# Altium schematic sheet MCU.SchDoc: Microcontroller
size A3; DrawnBy: Zoe Goodward; DocumentNumber: 2; Revision: 01; SheetNumber: 2; SheetTotal: 10; Version: 01; Project: Battery Managment System 2020; PageSetup: Record=PageOptions|CenterHorizontal=True|CenterVertical=True|PrintScale=0.97|XCorrection=1.00|YCorrection=1.00|PrintKind=0|BorderSize=5000000|LeftOffset=0|BottomOffset=0|Orientation=2|PaperLength=1000|PaperWidth=1000|Scale=100|PaperSource=7|PrintQuality=-4|MediaType=1|DitherType=10|PaperKind=A4|PrintScaleMode=1
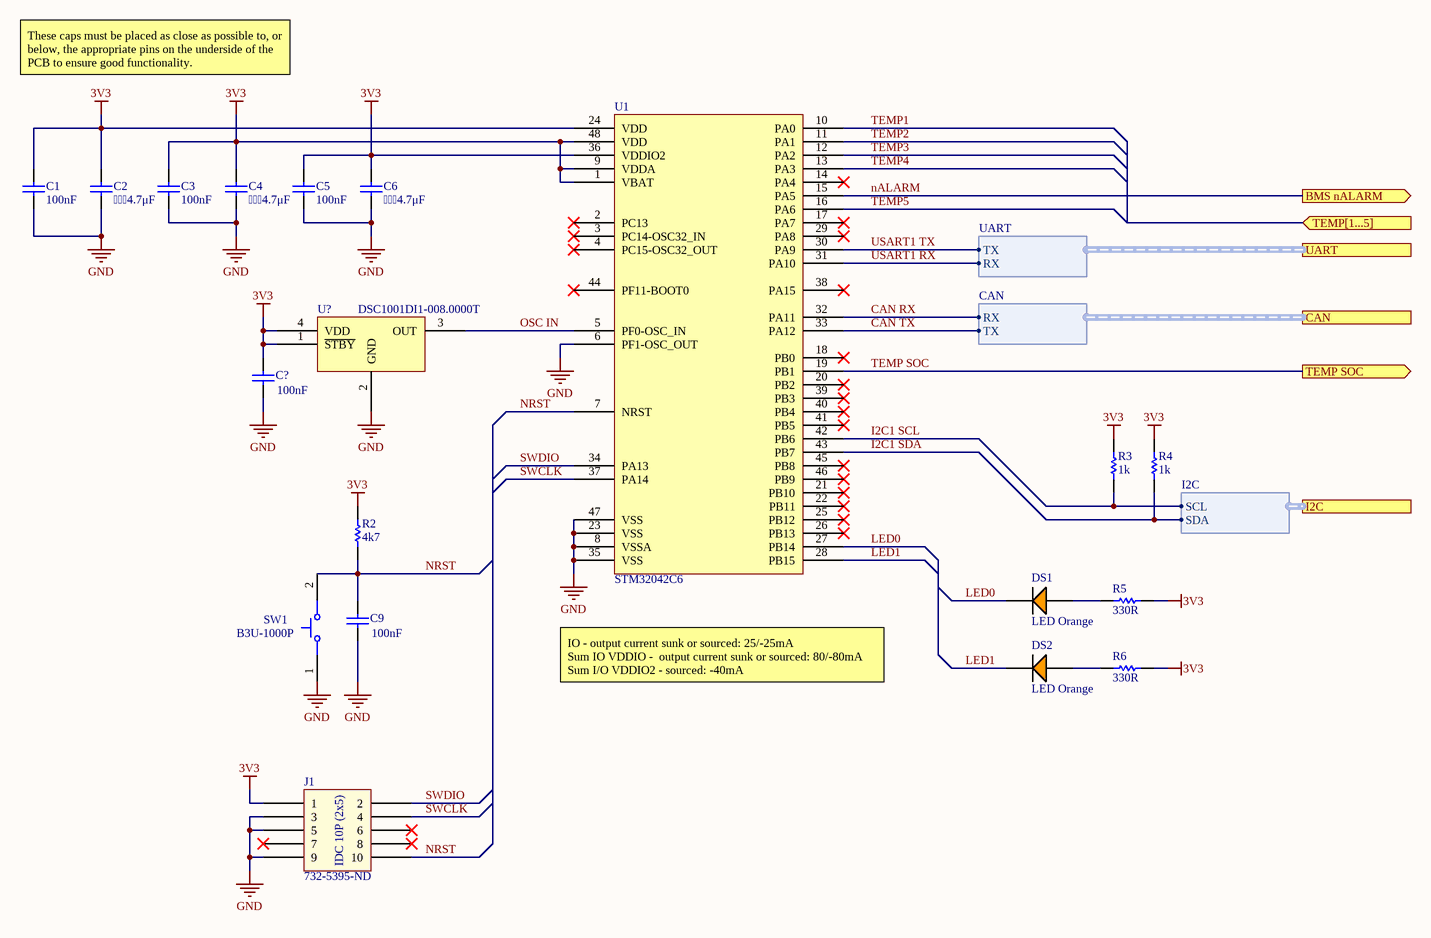
[diagram p0: MCU.SchDoc]

## Parts
C1  100nF  [CAPC1608X90X35ML15T15]
C2  4.7μF  [CAPC1608X87X35NL15T15]
C3  100nF  [CAPC1608X90X35ML15T15]
C4  4.7μF  [CAPC1608X87X35NL15T15]
C5  100nF  [CAPC1608X90X35ML15T15]
C6  4.7μF  [CAPC1608X87X35NL15T15]
C9  100nF  [CAPC0603(1608)100_N]
C?  100nF  [CAPC0603(1608)100_N]
DS1  LED Orange  [LED ORANGE 0603]
DS2  LED Orange  [LED ORANGE 0603]
J1  732-5395-ND  [IDC_10P]
R2  4k7  [RESC0603(1608)_N]
R3  1k  [RESC1608X55X30ML15T15]
R4  1k  [RESC1608X55X30ML15T15]
R5  330R  [RESC0603(1608)_L]
R6  330R  [RESC0603(1608)_L]
SW1  B3U-1000P  [OMRON-B3U-1000_V]
U1  STM32042C6  [STM32F042C6]
U?  DSC1001DI1-008.0000T  [DSC1001DI1-008.0000TCT-ND]

## Ports
BMS nALARM (out), CAN (harness CAN), I2C (harness I2C), TEMP SOC (out), TEMP[1...5] (in), UART (harness UART)

## Harnesses
I2C: SCL, SDA
CAN: RX, TX
UART: TX, RX

## Nets
3V3: C1.2 C2.2 C3.2 C4.2 C5.2 C6.2 C?.2 J1.1 R2.2 R3.2 R4.2 R5.1 R6.1 U1.1(VBAT) U1.9(VDDA) U1.24(VDD) U1.36(VDDIO2) U1.48(VDD) U?.1(~{STBY}) U?.4(VDD)
GND: C1.1 C2.1 C3.1 C4.1 C5.1 C6.1 C9.1 C?.1 J1.3 J1.5 J1.9 SW1.1 U1.6(PF1-OSC_OUT) U1.8(VSSA) U1.23(VSS) U1.35(VSS) U1.47(VSS) U?.2(GND)
CAN RX: U1.32(PA11) ; port CAN.RX
CAN TX: U1.33(PA12) ; port CAN.TX
I2C1 SCL: R3.1 U1.42(PB6) ; port I2C.SCL
I2C1 SDA: R4.1 U1.43(PB7) ; port I2C.SDA
LED0: DS1.2(C) U1.27(PB14)
LED1: DS2.2(C) U1.28(PB15)
nALARM: U1.15(PA5) ; port BMS nALARM
NRST: C9.2 J1.10 R2.1 SW1.2 U1.7(NRST)
OSC IN: U1.5(PF0-OSC_IN) U?.3(OUT)
SWCLK: J1.4 U1.37(PA14)
SWDIO: J1.2 U1.34(PA13)
TEMP1: U1.10(PA0)
TEMP2: U1.11(PA1)
TEMP3: U1.12(PA2)
TEMP4: U1.13(PA3)
TEMP5: U1.16(PA6)
TEMP SOC: U1.19(PB1) ; port TEMP SOC
USART1 RX: U1.31(PA10) ; port UART.RX
USART1 TX: U1.30(PA9) ; port UART.TX
NetDS1_1: DS1.1(A) R5.2
NetDS2_1: DS2.1(A) R6.2

Not connected (* = marked no-connect by the designer): J1 6* 7* 8*; U1 2(PC13)* 3(PC14-OSC32_IN)* 4(PC15-OSC32_OUT)* 14(PA4)* 17(PA7)* 18(PB0)* 20(PB2)* 21(PB10)* 22(PB11)* 25(PB12)* 26(PB13)* 29(PA8)* 38(PA15)* 39(PB3)* 40(PB4)* 41(PB5)* 44(PF11-BOOT0)* 45(PB8)* 46(PB9)*

## Notes on the sheet
- These caps must be placed as close as possible to, or below, the appropriate pins on the underside of the PCB to ensure good functionality.
- IO - output current sunk or sourced: 25/-25mA
  Sum IO VDDIO -  output current sunk or sourced: 80/-80mA
  Sum I/O VDDIO2 - sourced: -40mA
- Revision History:
- Sheet Title:
- Rev
- Date
- Description
- Project:
- Size:
- Drawn By:
- A3
- Number:
- Revision:
- Sheet
- Version:
- of
- QUT Motorsport
- O-120, Gardens Point
- 2 George Street
- Brisbane, QLD 4000
- Australia
- Print Date:
- Print Time:
- File Name:
- (in symbol IDC_10P_2x5) IDC 10P (2x5)

## Library data of the parts
C1 C3 C5 = CMP-2006-04387-1: Manufacturer: AVX Interconnect / Elco; Part Number: 06035C104K4T4A
C2 C4 C6 = CMP-2006-03238-1: Part Number: C0603C475K8PACTU; Manufacturer: Kemet
C9 C? = CMP-1035-02584-1: CAP 100nF 16V ±10% 0603 (1608 Metric) Thickness 1mm SMD; Tolerance: Â±10%; Case-EIA: 0603; Case-Metric: 1608; Technology: SMT; Max Thickness: 1 mm; Value: 100nF; Rated Voltage: 16 V
DS1 DS2 = LED ORANGE 0603
J1 = IDC_10P_2x5
R2 = CMP-1012-00098-1: 10K 0.1W 5% 0603 (1608 Metric)  SMD; Case-EIA: 0603; Value: 10000.00 Ohm; Case-Metric: 1608; Technology: SMT; Tolerance: 5 %; Power: 0.1 W
R3 R4 = CMP-2000-00703-1: Part Number: ERJ-3GEYJ102V; Manufacturer: Panasonic
R5 R6 = CMP-1012-00062-1: 330R 0.1W 5% 0603 (1608 Metric)  SMD; Value: 330.00 Ohm; Case-EIA: 0603; Case-Metric: 1608; Tolerance: 5 %; Power: 0.1 W; Technology: SMT
SW1 = CMP-2100-03586-1: Ultra-Small Tactile Switch, 0.05 A, 12 V, -25 to 70 degC, 2-Pin SMD, RoHS, Tape and Reel; Manufacturer: Omron Electronic Components; Operating Force: 1.5N; Current Rating: 50mA; Voltage Rating (DC): 12V; Electrical Life: 200000Cycles; Actuator Length: 0.4mm; Insulation Resistance: 100MOhm; Switch Travel: 0.15mm; Throw Configuration: SPST; Illumination Type: Illuminated; Width: 3mm; Weight: 0.022g; Datasheet Version: 42005.0; Datasheet URL: http://www.omron.com/ecb/products/pdf/en-b3u.pdf; Height: 1.2mm; Package Quantity: 1; REACH SVHC: Unknown; Contact Current Rating: 50mA; Contact Material: Silver; Max Current Rating: 50mA; Package Reference: B3U-1000; Termination: SMD/SMT; Packaging: TapeandReel; Manufacturer URL: http://www.omron.com/; RoHSCompliant: true; Mount: SurfaceMount; Length: 4mm; Min Operating Temperature: -25degC; Depth: 2.5mm; Lead Free: LeadFree; Case/Package: SMD/SMT; Package Description: 2-Pin Surface Mount Device, Body 3 x 2.5 mm; Max Operating Temperature: 70degC; Orientation: Straight
U1 = STM32042C6: ARM® Cortex®-M0 STM32F0 Microcontroller IC 32-Bit 48MHz 32KB (32K x 8) FLASH 48-LQFP (7x7); ComponentLink1Description: Digikey; ComponentLink1URL: https://www.digikey.com.au/product-detail/en/stmicroelectronics/STM32F042C6T6TR/497-19319-1-ND/10063344; ComponentLink2Description: Datasheet; ComponentLink2URL: https://www.st.com/resource/en/datasheet/stm32f042k6.pdf
U? = DSC1001DI1-008.0000T: on 8MHz XO (Standard) CMOS Oscillator 1.8 ~ 3.3V Standby (Power Down) 4-SMD, No Lead